# Altium schematic sheet -2V5_DIST.SchDoc: -2.5V Distribution
size Letter; Organization: University of California; Address1: 475 Portola Plaza; Address2: Los Angeles, CA 90095; Revision: R01; SheetNumber: 1; SheetTotal: 1
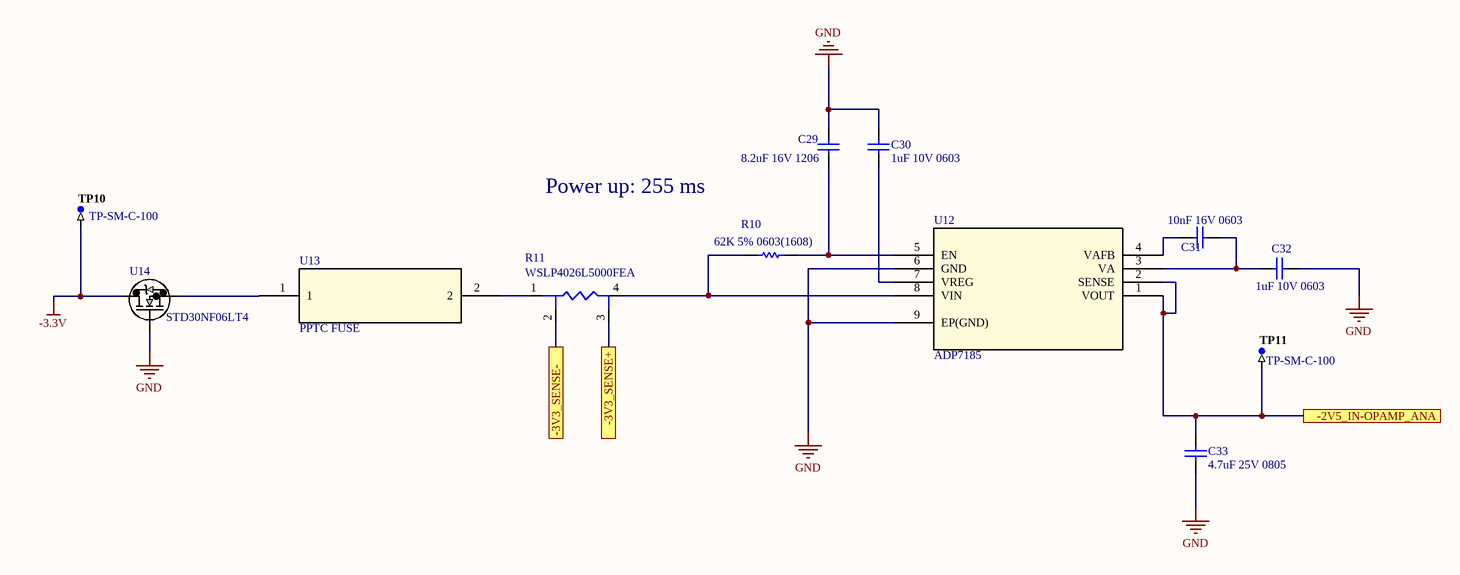
[diagram p0: -2V5_DIST.SchDoc]

## Parts
C29  8.2uF 16V 1206  [CAPC1206(3216)190_N]
C30  1uF 10V 0603  [CAPC0603(1608)100_L]
C31  10nF 16V 0603  [CAPC0603(1608)100_L]
C32  1uF 10V 0603  [CAPC0603(1608)100_L]
C33  4.7uF 25V 0805  [CAPC0805(2012)145_L]
R10  62K 5% 0603(1608)  [RESC0603(1608)_L]
R11  WSLP4026L5000FEA
TP10  TP-SM-C-100  [TP-SM-C-100]  (no BOM)
TP11  TP-SM-C-100  [TP-SM-C-100]  (no BOM)
U12  ADP7185  [CP_8_27]
U13  PPTC FUSE  [0ZCF]
U14  STD30NF06LT4  [DPAK]

## Ports
-2V5_IN-OPAMP_ANA, -3V3_SENSE+, -3V3_SENSE-

## Nets
-3.3V: TP10.1 U14.2(D)
GND: C29.2 C30.2 C32.2 C33.1 U12.6(GND) U12.9(EP(GND)) U14.1(G)
-2V5_IN-OPAMP_ANA: C33.2 TP11.1 U12.1(VOUT) U12.2(SENSE) ; port -2V5_IN-OPAMP_ANA
-3V3_SENSE+: R11.3 ; port -3V3_SENSE+
-3V3_SENSE-: R11.2 ; port -3V3_SENSE-
NetC29_1: C29.1 R10.2 U12.5(EN)
NetC30_1: C30.1 U12.7(VREG)
NetC31_1: C31.1 C32.1 U12.3(VA)
NetC31_2: C31.2 U12.4(VAFB)
NetR10_1: R10.1 R11.4 U12.8(VIN)
NetR11_1: R11.1 U13.2
NetU13_1: U13.1 U14.3(S)

## Notes on the sheet
- Power up: 255 ms
- 475 Portola Plaza
- GAPS TOF
- Title
- igarcia91@g.ucla.edu
- Los Angeles, CA
- 310-825-0344
- Size:
- Date:
- Letter
- Number:
- Time:
- Sheet
- Revision:
- of
- andrew.peck@cern.ch
- spq@ucla.edu
- File:

## Library data of the parts
C29 = CMP-1037-04959-1: CAP 8.2uF 16V ±20% 1206 (3216 Metric) Thickness 1.9mm SMD; Case-EIA: 1206; Case-Metric: 3216; Tolerance: Â±20%; Technology: SMT; Max Thickness: 1.9 mm; Value: 8.2uF; Rated Voltage: 16 V
C30 C32 = CMP-1035-02734-1: CAP 1uF 10V ±20% 0603 (1608 Metric) Thickness 1mm SMD; Tolerance: Â±20%; Case-EIA: 0603; Case-Metric: 1608; Technology: SMT; Value: 1uF; Max Thickness: 1 mm; Rated Voltage: 10 V
C31 = CMP-1035-02311-1: CAP 10nF 16V ±10% 0603 (1608 Metric) Thickness 1mm SMD; Case-EIA: 0603; Case-Metric: 1608; Tolerance: Â±10%; Rated Voltage: 16 V; Value: 10nF; Max Thickness: 1 mm; Technology: SMT
C33 = CMP-1036-04895-1: CAP 4.7uF 25V ±10% 0805 (2012 Metric) Thickness 1.45mm SMD; Case-Metric: 2012; Case-EIA: 0805; Tolerance: Â±10%; Value: 4.7uF; Technology: SMT; Rated Voltage: 25 V; Max Thickness: 1.45 mm
R10 = CMP-1012-00117-1: 62K 0.1W 5% 0603 (1608 Metric)  SMD; Value: 62000.00 Ohm; Case-Metric: 1608; Case-EIA: 0603; Technology: SMT; Power: 0.1 W; Tolerance: 5 %
R11 = WSLP4026L5000FEA: Current Sense Resistors - SMD 7watt .0005ohm 1%
TP10 TP11 = CMP-0484-00002-2: Test Point, Surface Mount, Circular, Pad Diameter 1 mm; Manufacturer: No Vendor; PartNumber: TP-SM-C-100
U12 = ADP7185ACPZN1.0-: LDO Voltage Regulators -500mA Ult low noise High Psrr negative; Manufacturer_Part_Number: ADP7185ACPZN1.0-R7; Vendor: Analog Devices Inc; Built_By: Analog Devices Inc.; RefDes: RefDes; Type: DEV; Value: Value
U13 = 0ZCF0250FF2C: Resettable Fuses - PPTC; Vendor: Belfuse; Built_By: EMA_UL_Team; C: Copyright (C) 2016 Accelerated Designs. All rights reserved; Manufacturer_Part_Number: 0ZCF0250FF2C; RefDes: RefDes; Type: DEV; Value: Value
U14 = STD30NF06LT4: MOSFET Automotive-grade N-channel 60 V, 19 mOhm typ., 24 A STripFET F6 Power MOSFET in a DPAK package; Vendor: STMicroelectronics; Built_By: EMA_UL_Team; C: Copyright (C) 2015 Accelerated Designs. All rights reserved; Manufacturer_Part_Number: STD30NF06LT4; RefDes: RefDes; Type: DEV; Value: Value